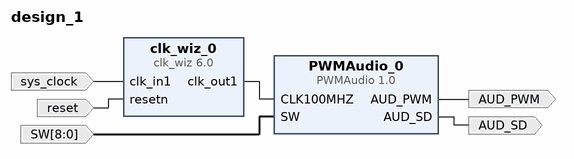
[diagram p0: block diagram of the top level]
# Vivado block design design_1, xc7a100tcsg324-1, Vivado 2020.1
create_bd_design design_1

create_bd_port -dir I -type clk sys_clock
set_property -dict {CONFIG.FREQ_HZ 100000000 CONFIG.PHASE 0.000} [get_bd_ports sys_clock]
create_bd_port -dir I -type rst reset
set_property -dict {CONFIG.POLARITY ACTIVE_LOW} [get_bd_ports reset]
create_bd_port -dir O AUD_PWM
create_bd_port -dir O AUD_SD
create_bd_port -dir I -from 8 -to 0 SW

create_bd_cell -type ip -vlnv Daniel.Eisen:user:PWMAudio:1.0 PWMAudio_0
create_bd_cell -type ip -vlnv xilinx.com:ip:clk_wiz:6.0 clk_wiz_0
set_property -dict [list \
  CONFIG.CLK_IN1_BOARD_INTERFACE sys_clock \
  CONFIG.RESET_BOARD_INTERFACE reset \
  CONFIG.RESET_PORT resetn \
  CONFIG.RESET_TYPE ACTIVE_LOW \
  CONFIG.USE_BOARD_FLOW true \
] [get_bd_cells clk_wiz_0]

# ---- connections ----

connect_bd_net [get_bd_ports sys_clock] [get_bd_pins clk_wiz_0/clk_in1]
connect_bd_net [get_bd_pins clk_wiz_0/clk_out1] [get_bd_pins PWMAudio_0/CLK100MHZ]
connect_bd_net [get_bd_ports reset] [get_bd_pins clk_wiz_0/resetn]
connect_bd_net [get_bd_pins PWMAudio_0/AUD_PWM] [get_bd_ports AUD_PWM]
connect_bd_net [get_bd_pins PWMAudio_0/AUD_SD] [get_bd_ports AUD_SD]
connect_bd_net [get_bd_ports SW] [get_bd_pins PWMAudio_0/SW]

validate_bd_design
save_bd_design
